# Altium schematic sheet Power_Neg.SchDoc
size A4; CompanyName: TH Nürnberg; Address1: Kesslerplatz 12; Address2: 90489 Nürnberg; Address3: GERMANY; SheetNumber: 7; SheetTotal: 10
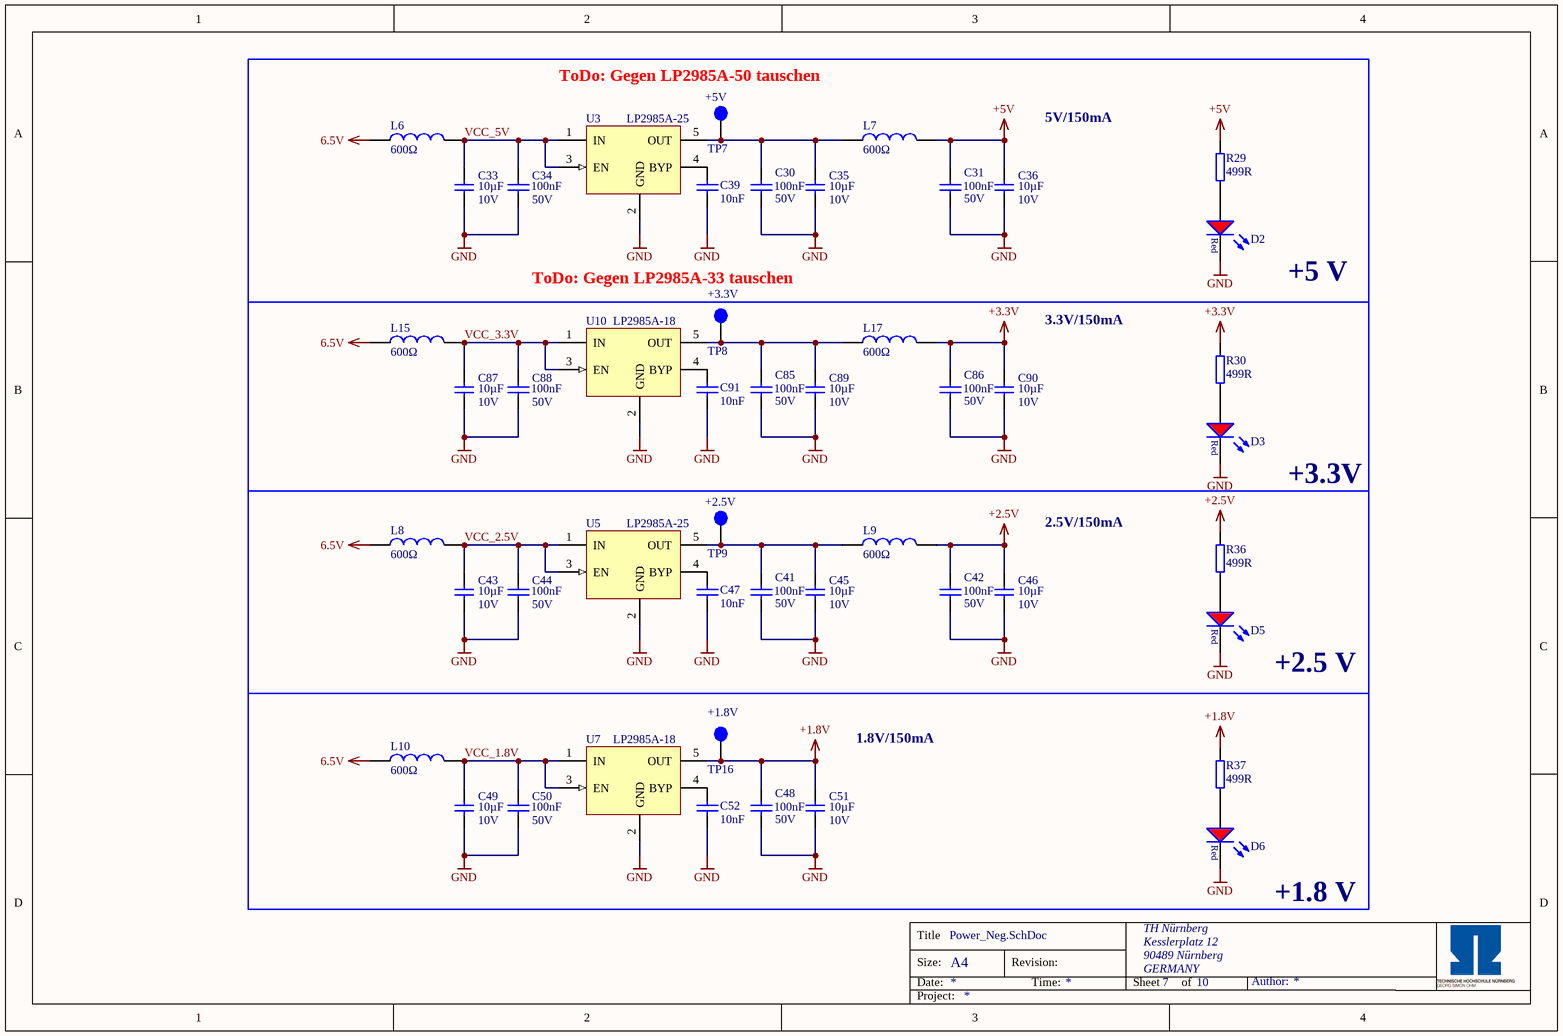
[diagram p0: Power_Neg.SchDoc]

## Parts
C30  100nF  Voltage: 50V  [CAPC1608X07N]
C31  100nF  Voltage: 50V  [CAPC1608X07N]
C33  10µF  Voltage: 10V  [C_1206]
C34  100nF  Voltage: 50V  [CAPC1608X07N]
C35  10µF  Voltage: 10V  [C_1206]
C36  10µF  Voltage: 10V  [C_1206]
C39  10nF  [CAPC1608X07N]
C41  100nF  Voltage: 50V  [CAPC1608X07N]
C42  100nF  Voltage: 50V  [CAPC1608X07N]
C43  10µF  Voltage: 10V  [C_1206]
C44  100nF  Voltage: 50V  [CAPC1608X07N]
C45  10µF  Voltage: 10V  [C_1206]
C46  10µF  Voltage: 10V  [C_1206]
C47  10nF  [CAPC1608X07N]
C48  100nF  Voltage: 50V  [CAPC1608X07N]
C49  10µF  Voltage: 10V  [C_1206]
C50  100nF  Voltage: 50V  [CAPC1608X07N]
C51  10µF  Voltage: 10V  [C_1206]
C52  10nF  [CAPC1608X07N]
C85  100nF  Voltage: 50V  [CAPC1608X07N]
C86  100nF  Voltage: 50V  [CAPC1608X07N]
C87  10µF  Voltage: 10V  [C_1206]
C88  100nF  Voltage: 50V  [CAPC1608X07N]
C89  10µF  Voltage: 10V  [C_1206]
C90  10µF  Voltage: 10V  [C_1206]
C91  10nF  [CAPC1608X07N]
D2  150060RS75000  [WL-SMCW_0603]  (value not drawn)
D3  150060RS75000  [WL-SMCW_0603]  (value not drawn)
D5  150060RS75000  [WL-SMCW_0603]  (value not drawn)
D6  150060RS75000  [WL-SMCW_0603]  (value not drawn)
L6  600Ω  [WE-CBF_0805_High Current]
L7  600Ω  [WE-CBF_0805_High Current]
L8  600Ω  [WE-CBF_0805_High Current]
L9  600Ω  [WE-CBF_0805_High Current]
L10  600Ω  [WE-CBF_0805_High Current]
L15  600Ω  [WE-CBF_0805_High Current]
L17  600Ω  [WE-CBF_0805_High Current]
R29  499R  [RESC1608X06N]
R30  499R  [RESC1608X06N]
R36  499R  [RESC1608X06N]
R37  499R  [RESC1608X06N]
TP7  +5V  [TP_1mm]  (no BOM)
TP8  +3.3V  [TP_1mm]  (no BOM)
TP9  +2.5V  [TP_1mm]  (no BOM)
TP16  +1.8V  [TP_1mm]  (no BOM)
U3  LP2985A-25  [SOT95P250X110-5N]
U5  LP2985A-25  [SOT95P250X110-5N]
U7  LP2985A-18  [SOT95P250X110-5N]
U10  LP2985A-18  [SOT95P250X110-5N]

## Blocks framed on the sheet
+5 V: C30 C31 C33-C36 C39 D2 L6 L7 R29 TP7 U3

## Nets
6.5V: L6.1 L8.1 L10.1 L15.1
+1.8V: C48.1 C51.2 R37.2 TP16.1 U7.5(OUT)
+2.5V: C42.1 C46.2 L9.2 R36.2
+3.3V: C86.1 C90.2 L17.2 R30.2
+5V: C31.1 C36.2 L7.2 R29.2
GND: C30.2 C31.2 C33.1 C34.2 C35.1 C36.1 C39.1 C41.2 C42.2 C43.1 C44.2 C45.1 C46.1 C47.1 C48.2 C49.1 C50.2 C51.1 C52.1 C85.2 C86.2 C87.1 C88.2 C89.1 C90.1 C91.1 D2.1(K) D3.1(K) D5.1(K) D6.1(K) U3.2(GND) U5.2(GND) U7.2(GND) U10.2(GND)
VCC_1.8V: C49.2 C50.1 L10.2 U7.1(IN) U7.3(EN)
VCC_2.5V: C43.2 C44.1 L8.2 U5.1(IN) U5.3(EN)
VCC_3.3V: C87.2 C88.1 L15.2 U10.1(IN) U10.3(EN)
VCC_5V: C33.2 C34.1 L6.2 U3.1(IN) U3.3(EN)
NetC30_1: C30.1 C35.2 L7.1 TP7.1 U3.5(OUT)
NetC39_2: C39.2 U3.4(BYP)
NetC41_1: C41.1 C45.2 L9.1 TP9.1 U5.5(OUT)
NetC47_2: C47.2 U5.4(BYP)
NetC52_2: C52.2 U7.4(BYP)
NetC85_1: C85.1 C89.2 L17.1 TP8.1 U10.5(OUT)
NetC91_2: C91.2 U10.4(BYP)
NetD2_2: D2.2(A) R29.1
NetD3_2: D3.2(A) R30.1
NetD5_2: D5.2(A) R36.1
NetD6_2: D6.2(A) R37.1

## Notes on the sheet
- (near TP7) ToDo: Gegen LP2985A-50 tauschen
- 5V/150mA
- (near TP8) ToDo: Gegen LP2985A-33 tauschen
- 3.3V/150mA
- +3.3V
- 2.5V/150mA
- +2.5 V
- 1.8V/150mA
- +1.8 V
- Title
- Size:
- Date:
- A4
- Revision:
- Time:
- Sheet
- of
- Author:
- Project:

## Library data of the parts
C30 C31 C41 C42 C48 C85 C86 = Cap_0603: MPN: CC0603KRX7R9BB104; MF: Yageo; Dielectric: X5R; Value: 100nF; Supplier 1: Mouser; Supplier 2: Mouser; Supplier Part Number 1: 603-CC603KRX7R9BB104; Supplier Part Number 2: 710-885382206004; Package: 0603
C33 C35 C36 C43 C45 C46 C49 C51 C87 C89 C90 = C_1206: Capacitor 1206; MPN: CL31A106KPHNNNE; Tolerance: 10%; MF: Samsung Electro-Mechanics; Dielectric: X5R; Package: 1206; Value: 10µF; Created: 2020_09_17_Liegmann; Supplier 1: Mouser; Supplier Part Number 1: 187-CL31A106KPHNNNE
C34 C44 C50 C88 = Cap_0603: MPN: CC0603KRX7R9BB104; MF: Yageo; Tolerance: 10%; Dielectric: X5R; Value: 100nF; Supplier 1: Mouser; Supplier 2: Mouser; Supplier Part Number 1: 603-CC603KRX7R9BB104; Supplier Part Number 2: 710-885382206004; Package: 0603
C39 C47 C52 C91 = Cap_0603: MPN: 885012206065; MF: Würth; Voltage: 25V; Dielectric: X7R; Value: 10nF; Supplier 1: Mouser; Supplier 2: *; Supplier Part Number 1: 710-885012206065; Supplier Part Number 2: *; Package: 0603
D2 D3 D5 D6 = LED_Red_0603: WL-SMCW SMD Mono-color Chip LED Waterclear, size 0603, Red, 2 V, 140°; Forward Voltage: 2 V; Luminous Intensity: 250 mcd; Peak Wavelength: 630 nm; Dominant Wavelength: 625 nm; MF: Wuerth Elektronik; Published Date: Sep. 2017; ComponentLink1Description: Manufacturer; ComponentLink1URL: http://www.we-online.de; ComponentLink2Description: Datasheet; ComponentLink2URL: http://katalog.we-online.com/led/datasheet/150060RS75000.pdf; MPN: 150060RS75000; Size: 0603; Viewing Angle: 140°; Emitting Color: Red; Value: 150060RS75000; Package: 0603; Created: 2018_09_06_AGeiger; Supplier 1: Farnell; Supplier Part Number 1: 2322071; Supplier 2: Mouser; Supplier Part Number 2: 710-150060RS75000; Supplier 3: Digi-Key; Supplier Part Number 3: 732-4978-1-ND
L6-L10 L15 L17 = WE-CBF, 742792040: WE-CBF SMD EMI Suppression Ferrite Bead, 0805, 600Ω; MF: Wurth Elektronik; Type: High Current; PublishedDate: Aug 2016; ComponentLink1Description: Manufacturer; ComponentLink1URL: http://www.we-online.de; ComponentLink2Description: Datasheet; ComponentLink2URL: http://katalog.we-online.de/pbs/datasheet/742792040.pdf; MPN: 742792040; Value: 600Ω; Size: 0805; Supplier 1: Farnell; Supplier 2: Mouser; Supplier 3: Digi-Key; Supplier Part Number 1: 2761567; Supplier Part Number 2: 710-742792040; Supplier Part Number 3: 732-1620-1-ND
R29 R30 R36 R37 = R_0603: MPN: CRCW0603499RFKEAC; MF: Vishay / Dale; Value: 499R; Supplier 1: Mouser; Supplier Part Number 1: 71-CRCW0603499RFKEAC; Package: 0603
TP7-TP9 TP16 = TP_1mm: Testpoint 1mm; Created: 2018_06_25_AGeiger; Value: Testpoint 1mm
U3 U5 = LP2985A-25: 150mA, LDO, Vout = 2.5V, Vin,max = 16V; MF: Texas Instruments; MPN: LP2985A-25; Supplier 1: Mouser; Supplier Part Number 1: 595-LP2985A-25DBVR; Package: SOT-23-5; ComponentLink1Description: Manufacturer; ComponentLink1URL: https://www.ti.com/; ComponentLink2Description: Datasheet; ComponentLink2URL: https://www.ti.com/lit/ds/symlink/lp2985a.pdf
U7 U10 = LP2985A-18: 150mA, LDO, Vout = 1.8V , Vin,max = 16V; Manufacturer 1: Texas Instruments; Supplier 1: Mouser; Supplier Part Number 1: 595-LP2985A-18DBVJ; Package: SOT-23-5; ComponentLink1Description: Manufacturer; ComponentLink1URL: https://www.ti.com/; ComponentLink2Description: Datasheet; ComponentLink2URL: https://www.ti.com/lit/ds/symlink/lp2985a.pdf; Manufacturer Part Number 1: LP2985A-18